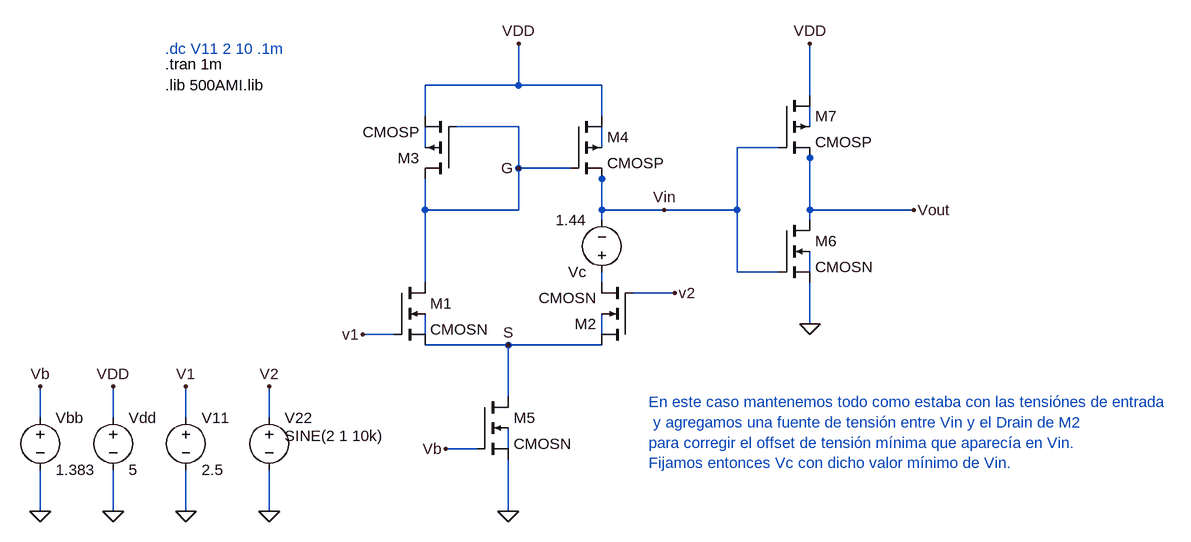
[diagram p0: schematic conversor v1.2.asc]
conversor v1.2.asc, the LTspice schematic file:
Version 4
SHEET 1 1864 680
WIRE 160 -240 160 -304
WIRE 160 -240 16 -240
WIRE 288 -240 160 -240
WIRE 608 -224 608 -304
WIRE 16 -192 16 -240
WIRE 288 -192 288 -240
WIRE 160 -176 64 -176
WIRE 608 -176 608 -208
WIRE 16 -144 16 -176
WIRE 288 -144 288 -176
WIRE 560 -144 496 -144
WIRE 608 -128 608 -144
WIRE 160 -112 160 -176
WIRE 240 -112 160 -112
WIRE 288 -96 288 -112
WIRE 16 -48 16 -96
WIRE 160 -48 160 -112
WIRE 160 -48 16 -48
WIRE 288 -48 288 -96
WIRE 384 -48 288 -48
WIRE 496 -48 496 -144
WIRE 496 -48 384 -48
WIRE 608 -48 608 -128
WIRE 768 -48 608 -48
WIRE 288 -32 288 -48
WIRE 608 -32 608 -48
WIRE 496 48 496 -48
WIRE 560 48 496 48
WIRE 608 48 608 16
WIRE 16 64 16 -48
WIRE 288 64 288 48
WIRE 400 80 336 80
WIRE 608 128 608 64
WIRE -32 144 -80 144
WIRE 16 144 16 112
WIRE 288 144 288 112
WIRE 144 160 16 160
WIRE 288 160 144 160
WIRE 144 240 144 160
WIRE -576 272 -576 224
WIRE -464 272 -464 224
WIRE -352 272 -352 224
WIRE -224 272 -224 224
WIRE 96 320 48 320
WIRE 144 320 144 288
WIRE -576 416 -576 352
WIRE -464 416 -464 352
WIRE -352 416 -352 352
WIRE -224 416 -224 352
WIRE 144 416 144 336
FLAG -464 416 0
FLAG 144 416 0
FLAG 48 320 Vb
FLAG 160 -304 VDD
FLAG -464 224 VDD
FLAG -352 416 0
FLAG -352 224 V1
FLAG -224 416 0
FLAG -224 224 V2
FLAG -576 416 0
FLAG -576 224 Vb
FLAG 608 128 0
FLAG 608 -304 VDD
FLAG 384 -48 Vin
FLAG -80 144 v1
FLAG 400 80 v2
FLAG 144 160 S
FLAG 160 -112 G
FLAG 768 -48 Vout
SYMBOL pmos4 240 -192 R0
SYMATTR InstName M4
SYMATTR Value CMOSP
SYMATTR Value2 l=10u w=10u
SYMBOL nmos4 96 240 R0
SYMATTR InstName M5
SYMATTR Value CMOSN
SYMATTR Value2 l=10u w=10u
SYMBOL voltage -464 256 R0
WINDOW 123 0 0 Left 0
WINDOW 39 0 0 Left 0
SYMATTR InstName Vdd
SYMATTR Value 5
SYMBOL nmos4 336 160 R180
SYMATTR InstName M2
SYMATTR Value CMOSN
SYMATTR Value2 l=10u w=10u
SYMBOL pmos4 64 -96 R180
SYMATTR InstName M3
SYMATTR Value CMOSP
SYMATTR Value2 l=10u w=10u
SYMBOL voltage -352 256 R0
WINDOW 123 0 0 Left 0
WINDOW 39 0 0 Left 0
SYMATTR InstName V11
SYMATTR Value 2.5
SYMBOL voltage -224 256 R0
WINDOW 3 24 44 Left 2
WINDOW 123 0 0 Left 0
WINDOW 39 0 0 Left 0
SYMATTR InstName V22
SYMATTR Value SINE(2 1 10k)
SYMBOL voltage -576 256 R0
WINDOW 123 0 0 Left 0
WINDOW 39 0 0 Left 0
SYMATTR InstName Vbb
SYMATTR Value 1.383
SYMBOL nmos4 -32 64 R0
SYMATTR InstName M1
SYMATTR Value CMOSN
SYMATTR Value2 l=10u w=10u
SYMBOL nmos4 560 -32 R0
SYMATTR InstName M6
SYMATTR Value CMOSN
SYMATTR Value2 l=10u w=10u
SYMBOL pmos4 560 -224 R0
SYMATTR InstName M7
SYMATTR Value CMOSP
SYMATTR Value2 l=10u w=10u
SYMBOL voltage 288 64 R180
WINDOW 123 0 0 Left 0
WINDOW 39 0 0 Left 0
SYMATTR InstName Vc
SYMATTR Value 1.44
TEXT -384 -272 Left 2 !.tran 1m
TEXT -384 -296 Left 2 ;.dc V11 2 10 .1m
TEXT -384 -240 Left 2 !.lib 500AMI.lib
TEXT 360 248 Left 2 ;En este caso mantenemos todo como estaba con las tensiónes de entrada\n y agregamos una fuente de tensión entre Vin y el Drain de M2\npara corregir el offset de tensión mínima que aparecía en Vin. \nFijamos entonces Vc con dicho valor mínimo de Vin.

The netlist it stands for:
* conversor v1.2.asc
M4 VDD G Vin N003 CMOSP l=10u w=10u
M5 S Vb 0 N008 CMOSN l=10u w=10u
Vdd VDD 0 5
M2 S V2 N005 N007 CMOSN l=10u w=10u
M3 G G VDD N002 CMOSP l=10u w=10u
V11 V1 0 2.5
V22 V2 0 SINE(2 1 10k)
Vbb Vb 0 1.383
M1 G V1 S N006 CMOSN l=10u w=10u
M6 Vout Vin 0 N004 CMOSN l=10u w=10u
M7 VDD Vin Vout N001 CMOSP l=10u w=10u
Vc N005 Vin 1.44
.model NMOS NMOS
.model PMOS PMOS
.lib standard.mos
.tran 1m
* .dc V11 2 10 .1m
.lib 500AMI.lib
* En este caso mantenemos todo como estaba con las tensiónes de entrada
*  y agregamos una fuente de tensión entre Vin y el Drain de M2
* para corregir el offset de tensión mínima que aparecía en Vin.
* Fijamos entonces Vc con dicho valor mínimo de Vin.
.backanno
.end